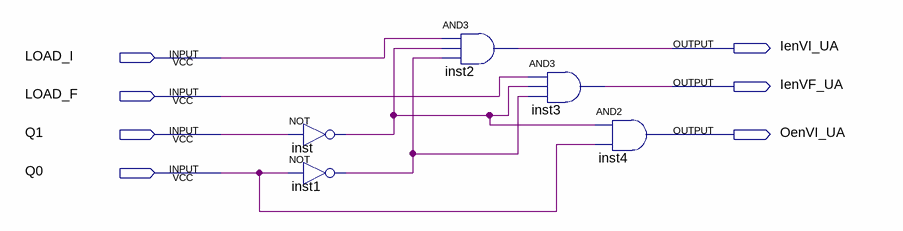
[diagram p0: schematic sheet]
// Quartus schematic UC_de_UA.bdf as structural Verilog: 5 symbols, 7 pins
module UC_de_UA (
  input  LOAD_I,
  input  LOAD_F,
  input  Q1,
  input  Q0,
  output IenVI_UA,
  output IenVF_UA,
  output OenVI_UA
);

  wire inst1_out, inst_out;

  not inst (inst_out, Q1);
  not inst1 (inst1_out, Q0);
  and inst2 (IenVI_UA, LOAD_I, inst_out, inst1_out);
  and inst3 (IenVF_UA, LOAD_F, inst_out, inst1_out);
  and inst4 (OenVI_UA, inst_out, Q0);
endmodule
